# Altium schematic sheet DSO_CPLD.SchDoc
size A4
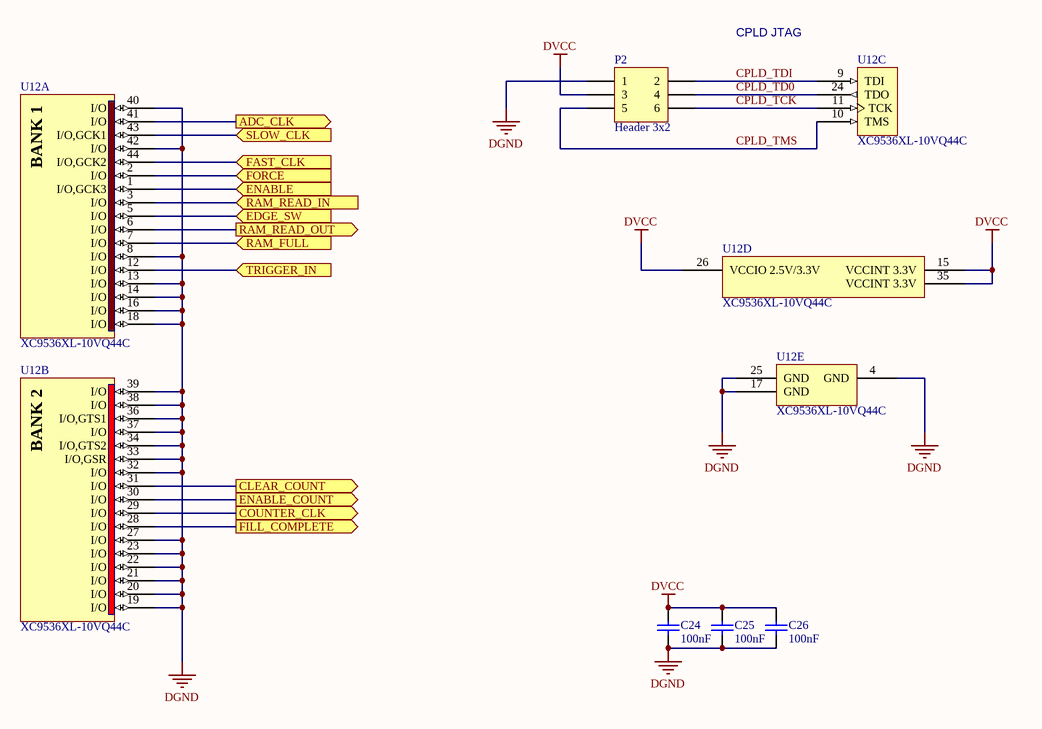
[diagram p0: DSO_CPLD.SchDoc]

## Parts
C24  100nF  [0805C]
C25  100nF  [0805C]
C26  100nF  [0805C]
P2  Header 3x2  [HDR3x2]
U12  XC9536XL-10VQ44C  [VQ44_L]  (parts A,B,C,D,E of 5)

## Ports
ADC_CLK (out), CLEAR_COUNT (out), COUNTER_CLK (out), EDGE_SW (in), ENABLE (in), ENABLE_COUNT (out), FAST_CLK (in), FILL_COMPLETE (out), FORCE (in), RAM_FULL (in), RAM_READ_IN (in), RAM_READ_OUT (out), SLOW_CLK (in), TRIGGER_IN (in)

## Nets
DGND: C24.2 C25.2 C26.2 P2.1 U12.4(GND) U12.8(I/O) U12.13(I/O) U12.14(I/O) U12.16(I/O) U12.17(GND) U12.18(I/O) U12.19(I/O) U12.20(I/O) U12.21(I/O) U12.22(I/O) U12.23(I/O) U12.25(GND) U12.27(I/O) U12.32(I/O) U12.33(I/O,GSR) U12.34(I/O,GTS2) U12.36(I/O,GTS1) U12.37(I/O) U12.38(I/O) U12.39(I/O) U12.40(I/O) U12.42(I/O)
DVCC: C24.1 C25.1 C26.1 P2.3 U12.15(VCCINT_3.3V) U12.26(VCCIO_2.5V/3.3V) U12.35(VCCINT_3.3V)
ADC_CLK: U12.41(I/O) ; port ADC_CLK
CLEAR_COUNT: U12.31(I/O) ; port CLEAR_COUNT
COUNTER_CLK: U12.29(I/O) ; port COUNTER_CLK
CPLD_TCK: P2.6 U12.11(TCK)
CPLD_TD0: P2.4 U12.24(TDO)
CPLD_TDI: P2.2 U12.9(TDI)
CPLD_TMS: P2.5 U12.10(TMS)
EDGE_SW: U12.5(I/O) ; port EDGE_SW
ENABLE: U12.1(I/O,GCK3) ; port ENABLE
ENABLE_COUNT: U12.30(I/O) ; port ENABLE_COUNT
FAST_CLK: U12.44(I/O,GCK2) ; port FAST_CLK
FILL_COMPLETE: U12.28(I/O) ; port FILL_COMPLETE
FORCE: U12.2(I/O) ; port FORCE
RAM_FULL: U12.7(I/O) ; port RAM_FULL
RAM_READ_IN: U12.3(I/O) ; port RAM_READ_IN
RAM_READ_OUT: U12.6(I/O) ; port RAM_READ_OUT
SLOW_CLK: U12.43(I/O,GCK1) ; port SLOW_CLK
TRIGGER_IN: U12.12(I/O) ; port TRIGGER_IN

## Notes on the sheet
- CPLD JTAG
- (in symbol XC9536XL-10VQG44C, part A) BANK 1
- (in symbol XC9536XL-10VQG44C, part B) BANK 2

## Library data of the parts
C24-C26 = C: Capacitor; Reviewed by: RM - 2018/08/05; Revision: July-2002: Re-released for DXP Platform.; Value: 100nF; Supplier 1: *; Supplier Part Number 1: *
P2 = Header 3x2: Header, 5-Pin; Reviewed by: RM - 2018/08/05; Supplier 1: Digi-Key; Supplier Part Number 1: 952-2121-ND
U12 = XC9536XL-10VQG44C: FastFLASH XC900XL, 3.3V High-Performance 36 Macrocell CPLD, 34 User I/Os, 44-Pin VQFP, Speed Grade 10, Commercial Grade; Reviewed by: RM - 2018/08/05; Supplier 1: Digi-Key; Supplier Part Number 1: 122-1385-ND